# EAGLE design FRA_daughter_v2 (EAGLE 7.6.0)
CNAME: Sensor board v1; CREVISION: 01
Assembly variants: ESP8266 CH340 default
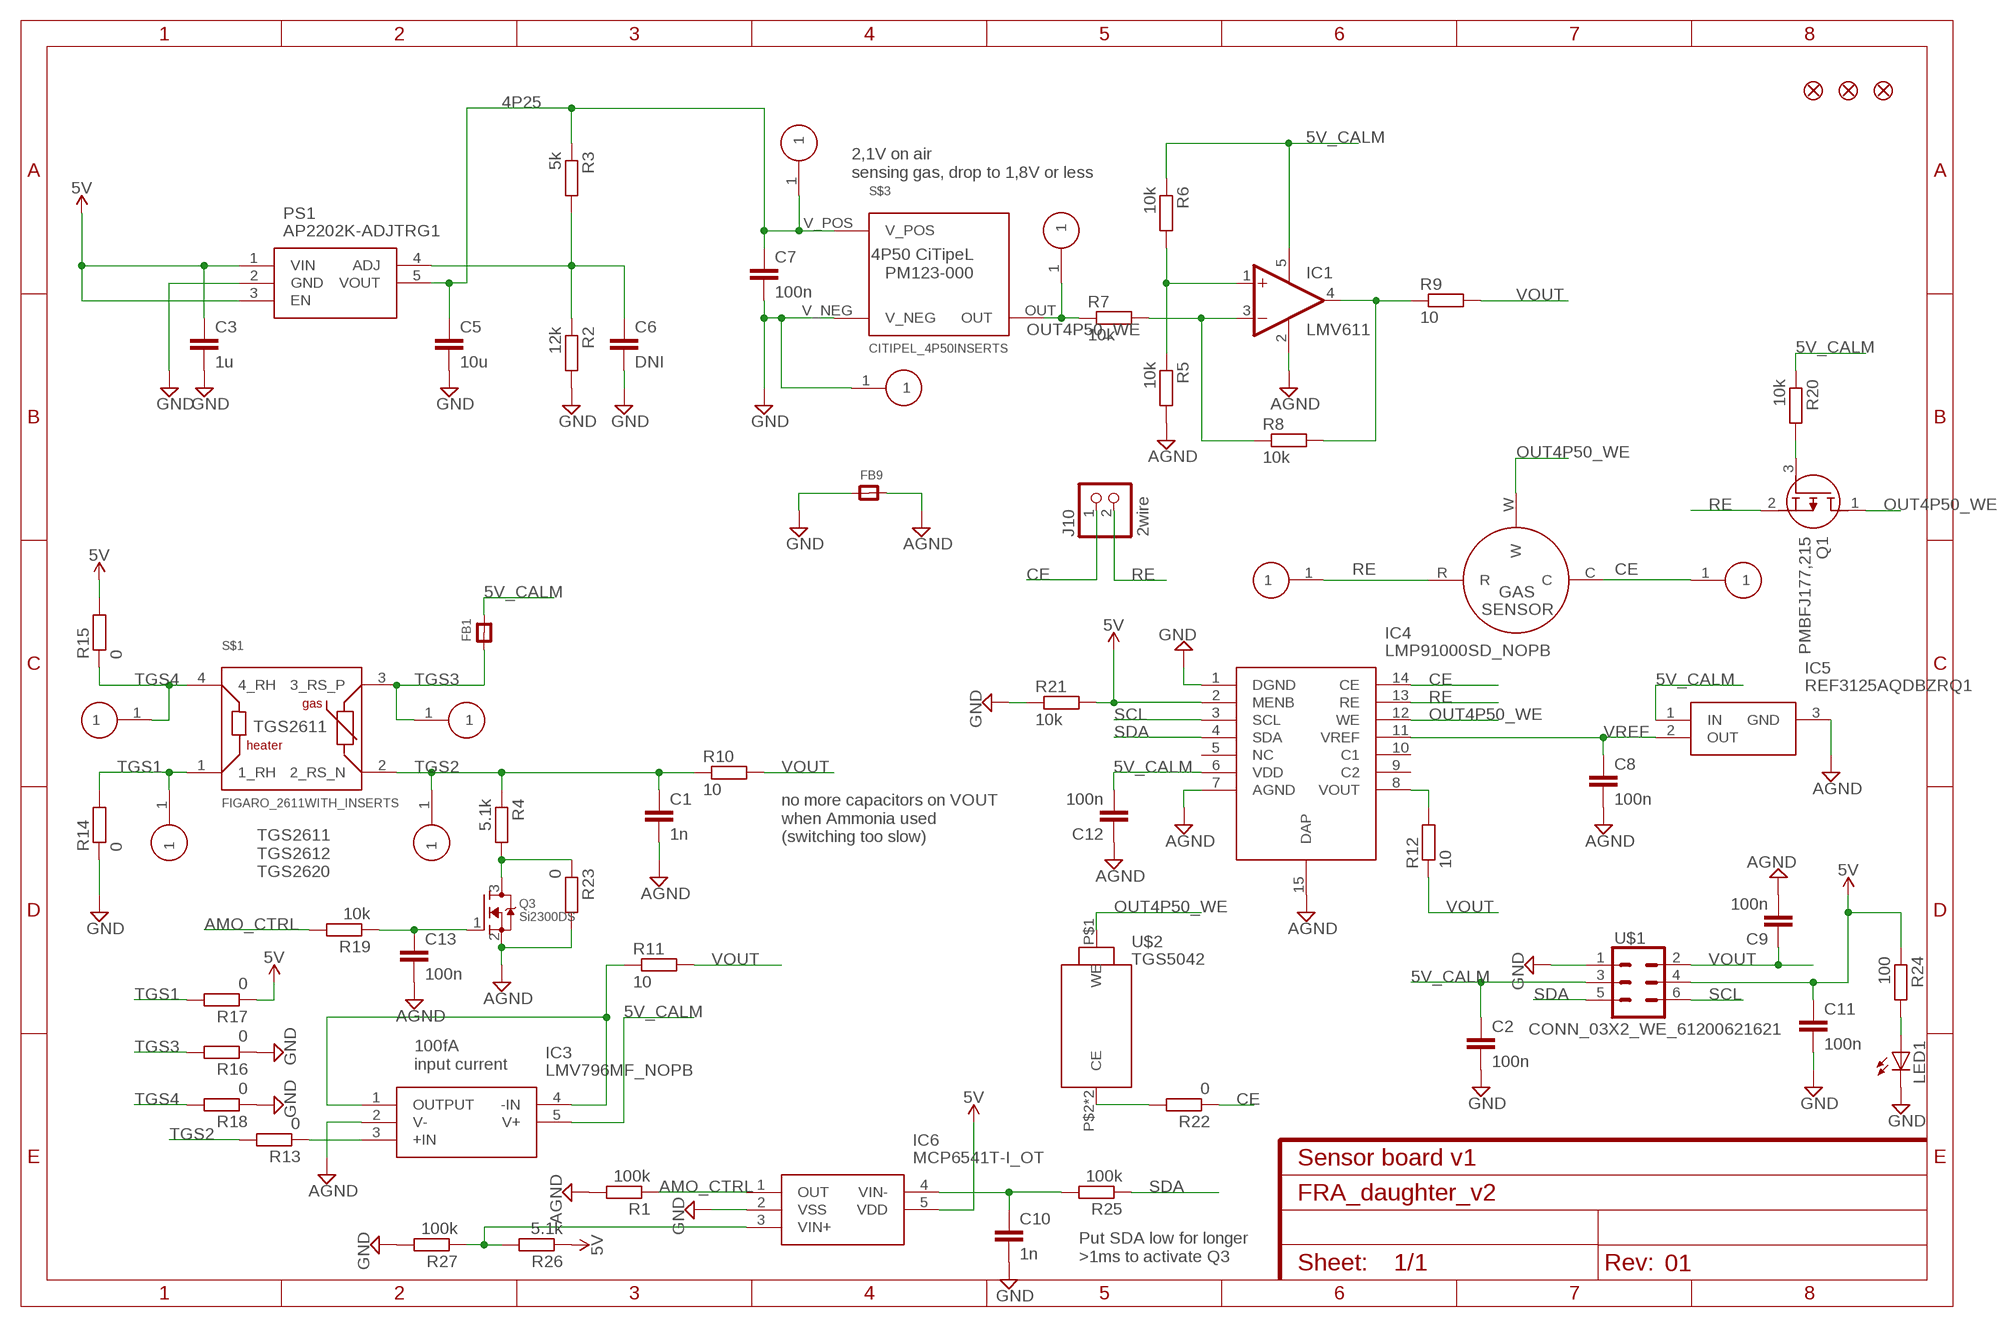
[diagram p0: schematic, sheet 1]

## Parts
C1  1n  C-EUC0603K  [C0603K]
C2  100n  C-EUC0603K  [C0603K]
C3  1u  C-EUC0603K  [C0603K]
C5  10u  C-EUC0603K  [C0603K]
C6  DNI  C-EUC0603K  [C0603K]
C7  100n  C-EUC0603K  [C0603K]
C8  100n  C-EUC0603K  [C0603K]
C9  100n  C-EUC0603K  [C0603K]
C10  1n  C-EUC0603K  [C0603K]
C11  100n  C-EUC0603K  [C0603K]
C12  100n  C-EUC0603K  [C0603K]
C13  100n  C-EUC0603K  [C0603K]
FB1  FERRITE  [0603]
FB9  FERRITE  [0603]
FID1  FIDUCIAL""  [FIDUCIAL_1MM]
FID2  FIDUCIAL""  [FIDUCIAL_1MM]
FID4  FIDUCIAL""  [FIDUCIAL_1MM]
IC1  LMV611  OPA333DCK  [SC70-5L]
IC3  LMV796MF_NOPB  [SOT95P280X145-5N]
IC4  LMP91000SD_NOPB  [SON50P400X400X80-15N]
IC5  REF3125AQDBZRQ1  [SOT95P237X112-3N]
IC6  MCP6541T-I_OT  [SOT95P270X145-5N]
J1  INSERT_MM5_06691.5MM  [INSERT_1MM5_9372]
J2  TGS3  INSERT_MM5_0669  [INSERT_MM5_0669]
J3  TGS2  INSERT_MM5_0669  [INSERT_MM5_0669]
J4  TGS1  INSERT_MM5_0669  [INSERT_MM5_0669]
J5  TGS4  INSERT_MM5_0669  [INSERT_MM5_0669]
J6  INSERT_MM5_06691.5MM  [INSERT_1MM5_9372]
J7  INSERT_MM5_06691.5MM  [INSERT_1MM5_9372]
J8  INSERT_MM5_06691.5MM  [INSERT_1MM5_9372]
J9  INSERT_MM5_06691.5MM  [INSERT_1MM5_9372]
J10  2wire  PINHD-1X2  [1X02]
LED1  LEDCHIP-LED0603  [CHIP-LED0603]
PS1  AP2202K-ADJTRG1  [SOT95P280X145-5N]
Q1  PMBFJ177,215  [SOT95P230X110-3N]
Q3  Si2300DS  MOSFET-NREFLOW  [SOT23]
R1  100k  R-EU_R0603  [R0603]
R2  12k  R-EU_R0603  [R0603]
R3  5k  R-EU_R0603  [R0603]
R4  5.1k  R-EU_R0603  [R0603]  (not fitted in variant ESP8266 CH340 default)
R5  10k  R-EU_R0603  [R0603]
R6  10k  R-EU_R0603  [R0603]
R7  10k  R-EU_R0603  [R0603]
R8  10k  R-EU_R0603  [R0603]
R9  10  R-EU_R0603  [R0603]
R10  10  R-EU_R0603  [R0603]
R11  10  R-EU_R0603  [R0603]
R12  10  R-EU_R0603  [R0603]
R13  0  R-EU_R0603  [R0603]
R14  0  R-EU_R0603  [R0603]
R15  0  R-EU_R0603  [R0603]
R16  0  R-EU_R0603  [R0603]
R17  0  R-EU_R0603  [R0603]
R18  0  R-EU_R0603  [R0603]
R19  10k  R-EU_R0603  [R0603]
R20  10k  R-EU_R0603  [R0603]
R21  10k  R-EU_R0603  [R0603]
R22  0  R-EU_R0603  [R0603]
R23  0  R-EU_R0603  [R0603]
R24  100  R-EU_R0603  [R0603]
R25  100k  R-EU_R0603  [R0603]
R26  5.1k  R-EU_R0603  [R0603]
R27  100k  R-EU_R0603  [R0603]
S$1  FIGARO_2611WITH_INSERTS  [TH4_TGS2611_INSERTS]
S$3  CITIPEL_4P50INSERTS  [TH3_4P50_INSERTS]
U$1  CONN_03X2_WE_61200621621  [WE_61200621621]
U$2  TGS5042  [TGS5042]
X1  3-ELECTRODE-GAS-SENSORINS  [3-ELECTRODE_INSETRS]

## Nets
4P25: C5.1 C7.1 J6.1 PS1.5(VOUT) R3.1 S$3.V_POS
5V: C3.1 C11.1 IC4.2(MENB) IC6.5(VDD) PS1.1(VIN) PS1.3(EN) R15.2 R17.1 R21.2 R24.1 R26.1 U$1.4
5V_CALM: C2.1 C12.2 FB1.2 IC1.5(V+) IC3.5(V+) IC4.6(VDD) IC5.1(IN) R6.1 R20.1 U$1.3
AGND: C1.2 C8.2 C9.2 C12.1 C13.2 FB9.2 IC1.2(V-) IC3.2(V-) IC4.7(AGND) IC4.15(DAP) IC5.3(GND) Q3.2(S) R1.2 R5.2 R23.2
AMO_CTRL: IC6.1(OUT) R1.1 R19.2
CE: IC4.14(CE) J9.1 J10.1 R22.1 X1.C
GND: C2.2 C3.2 C5.2 C6.2 C7.2 C10.2 C11.2 FB9.1 IC4.1(DGND) IC6.2(VSS) J1.1 LED1.C PS1.2(GND) R2.2 R14.1 R16.1 R18.1 R21.1 R27.2 S$3.V_NEG U$1.1
N$1: LED1.A R24.2
N$2: C6.1 PS1.4(ADJ) R2.1 R3.2
N$3: IC4.8(VOUT) R12.2
N$4: IC1.1(+IN) R5.1 R6.2
N$5: IC1.3(-IN) R7.2 R8.1
N$6: IC1.4(OUT) R8.2 R9.1
N$7: IC3.1(OUTPUT) IC3.4(-IN) R11.1
N$8: C13.1 Q3.1(G) R19.1
N$9: Q1.3(G) R20.2
N$10: IC3.3(+IN) R13.1
N$15: Q3.3(D) R4.2 R23.1
N$19: R22.2 U$2.P$2(CE) U$2.P$3(CE)
N$21: C10.1 IC6.4(VIN-) R25.2
N$23: IC6.3(VIN+) R26.2 R27.1
OUT4P50_WE: IC4.12(WE) J7.1 Q1.1(D) R7.1 S$3.OUT U$2.P$1(WE) X1.W
RE: IC4.13(RE) J8.1 J10.2 Q1.2(S) X1.R
SCL: IC4.3(SCL) U$1.6
SDA: IC4.4(SDA) R25.1 U$1.5
TGS1: J4.1 R14.2 R17.2 S$1.1(1_RH)
TGS2: C1.1 J3.1 R4.1 R10.1 R13.2 S$1.2(2_RS_N)
TGS3: FB1.1 J2.1 R16.2 S$1.3(3_RS_P)
TGS4: J5.1 R15.1 R18.2 S$1.4(4_RH)
VOUT: C9.1 R9.2 R10.2 R11.2 R12.1 U$1.2
VREF: C8.1 IC4.11(VREF) IC5.2(OUT)
Unconnected: IC4.5(NC) IC4.9(C2) IC4.10(C1)

## Notes on the sheet
- 2,1V on air
  sensing gas, drop to 1,8V or less
- no more capacitors on VOUT
  when Ammonia used
  (switching too slow)
- TGS2611
  TGS2612
  TGS2620
- 100fA
  input current
- Put SDA low for longer
  >1ms to activate Q3

## Library data of the parts
C1-C3 C5-C13 = resistor:C-EU: CAPACITOR, European symbol
FB1 FB9 = microbuilder:FERRITE: Ferrite Bead 0603 MMZ1608B121C - 120 Ohm @ 100MHz, 600mA, 0.15 Ohm DC Resistance - Digikey: 445-2164-1-ND BK1608HW121-T - 120 Ohm, 600mA Ferrite Chip - Digikey: 587-1876-2-ND 0805 HZ0805B272R-10 - 2.7K Ohm @ 100MHz, 200mA, 0.8 Ohm DC Resistance - Digikey: 240-2504-1-ND (see also Murata BLM21BD272SN1L) MMZ2012Y152B - 1.5K Ohm @ 100MHz, 500mA, 0.4 Ohm DC Resistance - Digikey: 445-1560-1-ND - Mainly for high frequency (80-400MHz) MMZ2012R102A - 1K Ohm @ 100MHz, 500mA, 0.3 Ohm DC Resistance - Digikey: 445-1555-2-ND - More general purpose (10-200MHz); PARTNO: BLM18PG121SN1D
FID1 FID2 FID4 = microbuilder:FIDUCIAL: Fiducial Alignment Points Various fiducial points for machine vision alignment.
IC1 = linear:OPA333: 1.8V, microPOWER CMOS OPERATIONAL AMPLIFIERS Zerø-Drift Series Source: Texas Instruments (Burr-Brown) .. U11 opa333 Operational Amp.pdf
IC3 = SamacSys_Parts:LMV796MF_NOPB: Single 17 MHz, low noise, CMOS input, 1.8V operational amplifier Source: Datasheet <http://www.ti.com/lit/ds/symlink/lmv796.pdf>; DESCRIPTION: Single 17 MHz, low noise, CMOS input, 1.8V operational amplifier; HEIGHT: 1.45mm; MANUFACTURER_NAME: Texas Instruments; MANUFACTURER_PART_NUMBER: LMV796MF/NOPB; MOUSER_PART_NUMBER: 926-LMV796MF/NOPB; MOUSER_PRICE-STOCK: https://www.mouser.com/Search/Refine.aspx?Keyword=926-LMV796MF%2FNOPB
IC4 = SamacSys_Parts:LMP91000SD_NOPB: Configurable AFE Potentiostat for Low-Power Chemical Sensing Applications Source: Datasheet <http://www.ti.com/lit/ds/symlink/lmp91000.pdf>; DESCRIPTION: Configurable AFE Potentiostat for Low-Power Chemical Sensing Applications; HEIGHT: 0.8mm; MANUFACTURER_NAME: Texas Instruments; MANUFACTURER_PART_NUMBER: LMP91000SD/NOPB; MOUSER_PART_NUMBER: 926-LMP91000SD/NOPB; MOUSER_PRICE-STOCK: https://www.mouser.com/Search/Refine.aspx?Keyword=926-LMP91000SD%2FNOPB
IC5 = SamacSys_Parts:REF3125AQDBZRQ1: Automotive 20-ppm/C (max), 100-A, 3-pin SOT-23 series voltage reference Source: Datasheet <http://www.ti.com/lit/gpn/ref31-q1>; DESCRIPTION: Automotive 20-ppm/C (max), 100-A, 3-pin SOT-23 series voltage reference; HEIGHT: 1.12mm; MANUFACTURER_NAME: Texas Instruments; MANUFACTURER_PART_NUMBER: REF3125AQDBZRQ1; MOUSER_PART_NUMBER: 595-REF3125AQDBZRQ1; MOUSER_PRICE-STOCK: https://www.mouser.com/Search/Refine.aspx?Keyword=595-REF3125AQDBZRQ1
IC6 = SamacSys_Parts:MCP6541T-I_OT: Comparator Push-Pull RRIO 1.6V SOT23-5 Source: Datasheet <https://componentsearchengine.com/Datasheets/1/MCP6541T-I_OT.pdf>; DESCRIPTION: Comparator Push-Pull RRIO 1.6V SOT23-5; HEIGHT: 1.45mm; MANUFACTURER_NAME: Microchip; MANUFACTURER_PART_NUMBER: MCP6541T-I/OT; MOUSER_PART_NUMBER: 579-MCP6541T-I/OT; MOUSER_PRICE-STOCK: https://www.mouser.com/Search/Refine.aspx?Keyword=579-MCP6541T-I%2FOT
J1-J9 = FRA_eagle_lib:INSERT_MM5_0669
J10 = pinhead:PINHD-1X2: PIN HEADER; PARTNO: TSW-102-07-G-S
LED1 = adafruit:LED: LED OSRAM: - CHIPLED LG R971, LG N971, LY N971, LG Q971, LY Q971, LO R971, LY R971 LH N974, LH R974 LS Q976, LO Q976, LY Q976 LO Q996 - Hyper CHIPLED LW Q18S LB Q993, LB Q99A, LB R99A - SideLED LS A670, LO A670, LY A670, LG A670, LP A670 LB A673, LV A673, LT A673, LW A673 LH A674 LY A675 LS A676, LA A676, LO A676, LY A676, LW A676 LS A679, LY A679, LG A679 - Hyper Micro SIDELED® LS Y876, LA Y876, LO Y876, LY Y876 LT Y87S - SmartLED LW L88C, LW L88S LB L89C, LB L89S, LG L890 LS L89K, LO L89K, LY L89K LS L896, LA L896, LO L896, LY L896 - TOPLED LS T670, LO T670, LY T670, LG T670, LP T670 LSG T670, LSP T670, LSY T670, LOP T670, LYG T670 LG T671, LOG T671, LSG T671 LB T673, LV T673, LT T673, LW T673 LH T674 LS T676, LA T676, LO T676, LY T676, LB T676, LH T676, LSB T676, LW T676 LB T67C, LV T67C, LT T67C, LS T67K, LO T67K, LY T67K, LW E67C LS E67B, LA E67B, LO E67B, LY E67B, LB E67C, LV E67C, LT E67C LW T67C LS T679, LY T679, LG T679 LS T770, LO T770, LY T770, LG T770, LP T770 LB T773, LV T773, LT T773, LW T773 LH T774 LS E675, LA E675, LY E675, LS T675 LS T776, LA T776, LO T776, LY T776, LB T776 LHGB T686 LT T68C, LB T68C - Hyper Mini TOPLED® LB M676 - Mini TOPLED Santana® LG M470 LS M47K, LO M47K, LY M47K Source: http://www.osram.convergy.de/
PS1 = SamacSys_Parts:AP2202K-ADJTRG1: DiodesZetex AP2202K-ADJTRG1, Low Noise LDO Voltage Regulator, Adjustable 150mA, 2.3 13.2 V +/-2%, 5-Pin SOT-23 Source: Datasheet <https://componentsearchengine.com/Datasheets/1/AP2202K-ADJTRG1.pdf>; DESCRIPTION: DiodesZetex AP2202K-ADJTRG1, Low Noise LDO Voltage Regulator, Adjustable 150mA, 2.3 13.2 V +/-2%, 5-Pin SOT-23; HEIGHT: 1.45mm; MANUFACTURER_NAME: Diodes Inc.; MANUFACTURER_PART_NUMBER: AP2202K-ADJTRG1; MOUSER_PART_NUMBER: 621-AP2202K-ADJTRG1; MOUSER_PRICE-STOCK: https://www.mouser.com/Search/Refine.aspx?Keyword=621-AP2202K-ADJTRG1
Q1 = SamacSys_Parts:PMBFJ177,215: NXP PMBFJ177,215 P-channel JFET Transistor, 30 V, Idss 1.5 20mA, 3-Pin SOT-23 Source: Datasheet <https://componentsearchengine.com/Datasheets/1/PMBFJ177,215.pdf>; DESCRIPTION: NXP PMBFJ177,215 P-channel JFET Transistor, 30 V, Idss 1.5 20mA, 3-Pin SOT-23; HEIGHT: 1.1mm; MANUFACTURER_NAME: Nexperia; MANUFACTURER_PART_NUMBER: PMBFJ177,215; MOUSER_PART_NUMBER: 771-PMBFJ177-T/R; MOUSER_PRICE-STOCK: https://www.mouser.com/Search/Refine.aspx?Keyword=771-PMBFJ177-T%2FR
Q3 = adafruit:MOSFET-N: N-Channel Mosfet 2N7002E - 60V 260mA SOT23 [Digikey: 2N7002ET1GOSTR-ND] - REEL BSH103 - 30V 850mA SOT23 [Digikey: 568-5013-1-ND]
R1-R27 = resistor:R-EU_: RESISTOR, European symbol
S$1 = FRA_eagle_lib:FIGARO_2611: Combustible gas sensor Figaro TGS2611 Figaro TGS2611 datasheet <https://www.figaro.co.jp/en/product/docs/tgs2611_product_information_rev02.pdf> Heater and Cicuit Voltage: 5V +- 0.2 VDC
S$3 = FRA_eagle_lib:CITIPEL_4P50: Combustible gas sensor CiTiPeL 4P50 datasheet <https://www.citytech.com.cn/pdf-datasheets/4p50.pdf> Operating Voltage: 4.25V +- 0.02 VDC Operating current 56+- 6 mA Sensitivity 37mV +- 7mV/%methane
U$1 = FRA_eagle_lib:CONN_03X2_WE_61200621621: https://eu.mouser.com/ProductDetail/Wurth-Elektronik/61200621621?qs=sGAEpiMZZMs%252BGHln7q6pm%2FFhW%252BtWvhAgbNxkR%252BlwXp8Ip%2FAN9J9VOg%3D%3D https://eu.mouser.com/datasheet/2/445/6120xx21621-265830.pdf
U$2 = FRA_eagle_lib:TGS5042: TGS5042 CO sensor
X1 = gas-sensor:3-ELECTRODE-GAS-SENSOR: 3 electrode electrochemical sensors

## Board
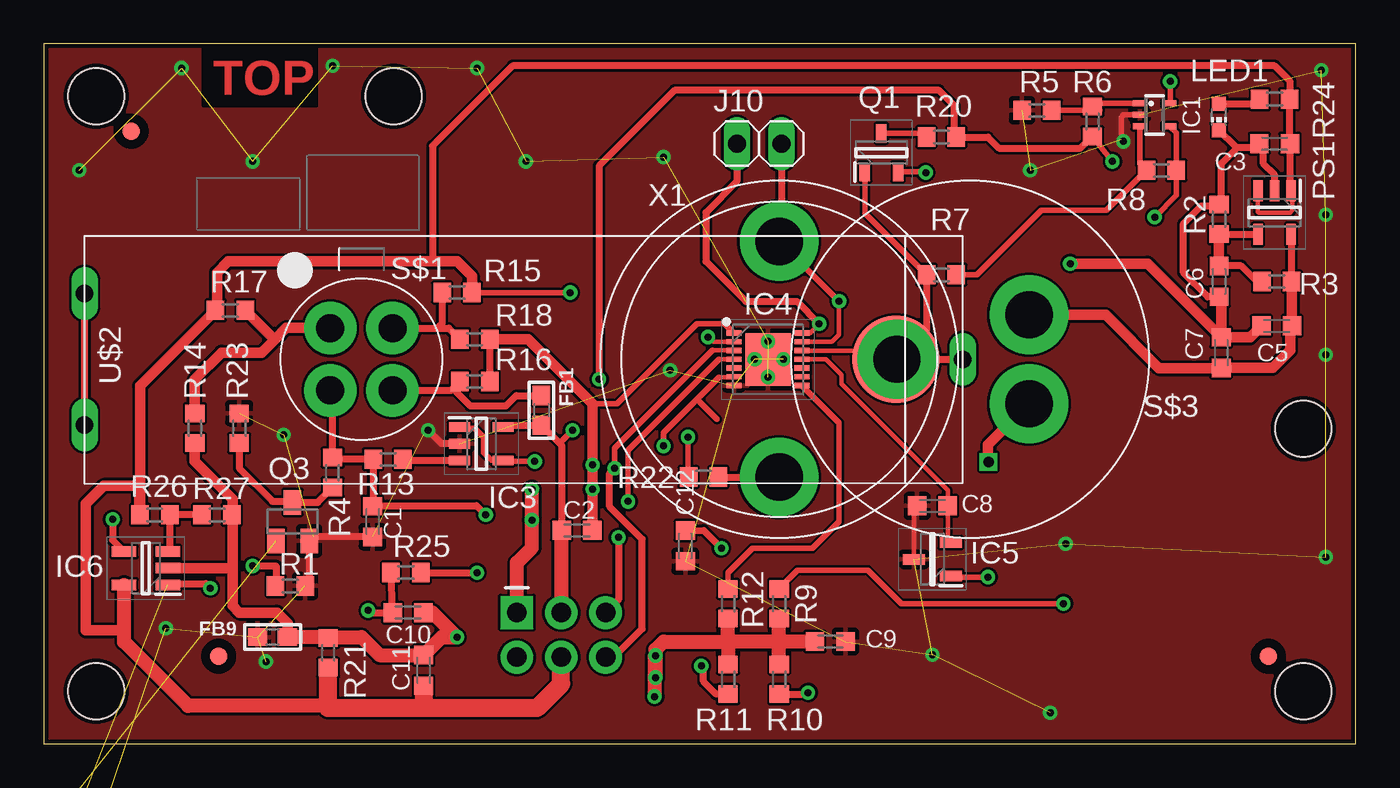
[diagram p1: board, top side]
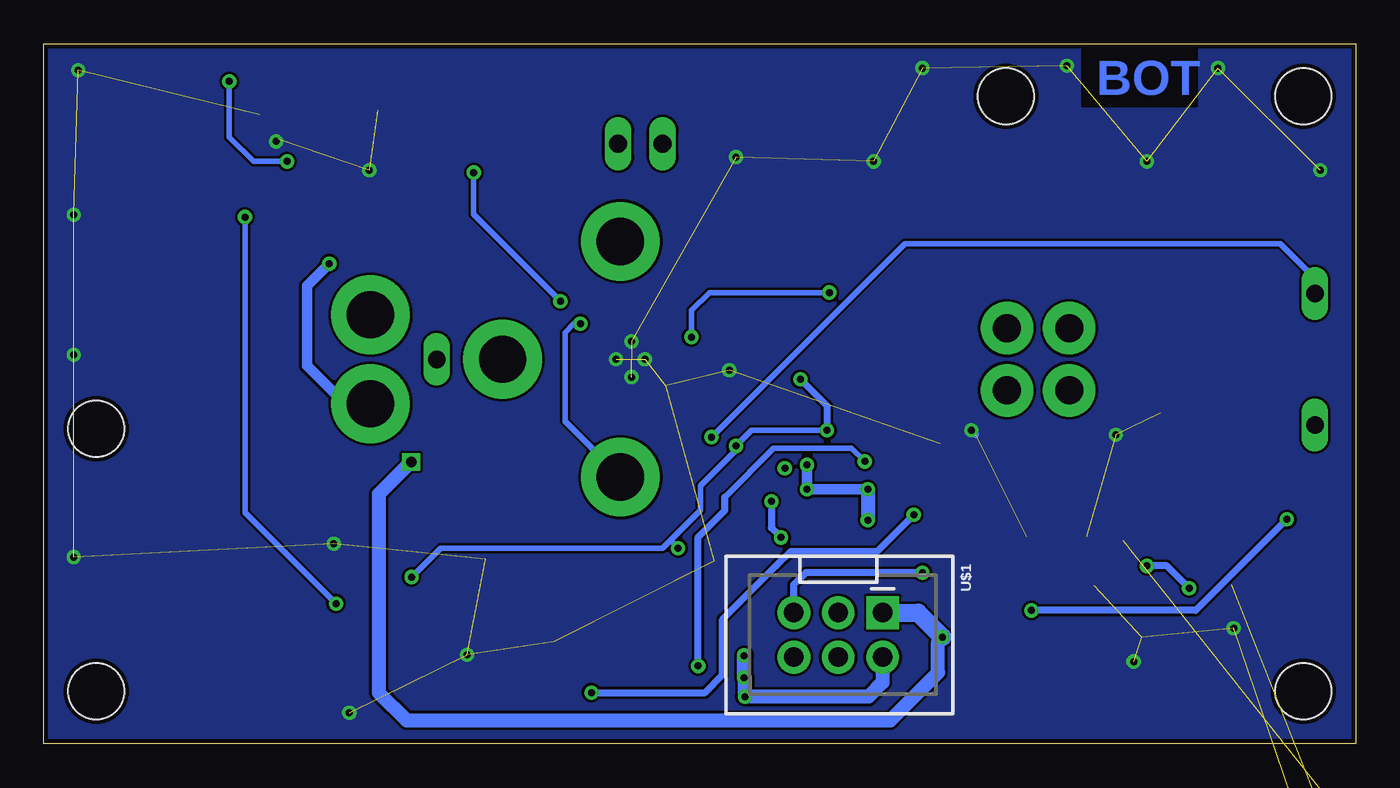
[diagram p2: board, bottom side, seen from below]

Size 75 x 40 mm. Coordinates in mm from the lower left corner, seen from the top.
Outline: 0,0 75,0 75,40 0,40 0,0
Copper layers (1*16): Top 0.035mm / dielectric 1.6mm / Bottom 0.035mm
Design rules "AllPCB": minimum track width 6mil, minimum drill 0.399mm, track to track 0.149859375mm, track to pad 0.149859375mm, pad to pad 8mil, via to via 17mil, smd to smd 6mil, copper to edge 10mil, drill to drill 24mil, minimum pad ring 10mil, minimum via ring 8mil, stop-mask expansion 4mil, vias tented up to drill 0.3mm, thermal gap 10mil
Holes 3.2 mm at 3,37 3,3 72,3 72,18 20,37
tRestrict: area 39.9,21.6 to 40.1,22.2; area 42.7,21.6 to 42.9,22.4; area 9,36.4 to 15.7,39.7
bRestrict: area 9,36.4 to 15.7,39.7

### Footprints (pad centres in the part's own frame; a part is rotated, then mirrored left to right if it is on the bottom)
C0603K = smd 1.05 x 1.08: 1 -0.875,0; 2 0.875,0
0603 = smd 1.1 x 1: 1 -0.85,0; 2 0.85,0
FIDUCIAL_1MM = smd 1 x 1: 1 0,0
SC70-5L = smd 0.35 x 0.8: 1 -0.65,-0.85; 2 0,-0.85; 3 0.65,-0.85; 4 0.65,0.85; 5 -0.65,0.85
SOT95P280X145-5N = smd 1.2 x 0.55: 1 -1.25,0.95; 2 -1.25,0; 3 -1.25,-0.95; 4 1.25,-0.95; 5 1.25,0.95
SON50P400X400X80-15N = smd 0.85 x 0.3: 1 -1.95,1.5; 2 -1.95,1; 3 -1.95,0.5; 4 -1.95,0; 5 -1.95,-0.5; 6 -1.95,-1; 7 -1.95,-1.5; 8 1.95,-1.5; 9 1.95,-1; 10 1.95,-0.5; 11 1.95,0; 12 1.95,0.5; 13 1.95,1; 14 1.95,1.5 | smd 2.6 x 3: 15 0,0
SOT95P237X112-3N = smd 1.25 x 0.6: 1 -1.05,0.95; 2 -1.05,-0.95; 3 1.05,0
SOT95P270X145-5N = smd 1.4 x 0.6: 1 -1.25,0.95; 2 -1.25,0; 3 -1.25,-0.95; 4 1.25,-0.95; 5 1.25,0.95
INSERT_1MM5_9372 = drill 2.7 pad 4.5: 1 0,0
INSERT_MM5_0669 = drill 1.6 pad 3: 1 0,0
1X02 = drill 1.016 long: 1 -1.27,0; 2 1.27,0
CHIP-LED0603 = smd 0.8 x 0.8: A 0,-0.75; C 0,0.75
SOT95P230X110-3N = smd 1.05 x 0.6: 1 -1.1,0.95; 2 -1.1,-0.95; 3 1.1,0
SOT23 = smd 1 x 1.4: 1 -0.95,-1.1; 2 0.95,-1.1; 3 0,1.1
R0603 = smd 1 x 1.1: 1 -0.85,0; 2 0.85,0
TH4_TGS2611_INSERTS = smd 2.5 x 2.5: 1 -1.8,1.8; 2 -1.8,-1.8; 3 1.8,-1.8; 4 1.8,1.8
TH3_4P50_INSERTS = smd 5 x 5: OUT 4.24,0 | smd 3.81 x 3.81: V_NEG -3.38,2.54; V_POS -3.38,-2.54
WE_61200621621 = drill 1.1 pad 1.88 square: 1 -1.27,2.54 | drill 1.1 pad 1.88: 2 1.27,2.54; 3 -1.27,0; 4 1.27,0; 5 -1.27,-2.54; 6 1.27,-2.54
TGS5042 = drill 1 long: P$1 0,25.1; P$2 -3.75,-25.1; P$3 3.75,-25.1
3-ELECTRODE_INSETRS = smd 3.7 x 3.7: C 6.75,0; R -6.75,0; W 0,6.75

### Placement (x,y rotation side)
C1  18.8,12.7 270 top
C2  30.48,12.19 0 top
C3  70.36,34.29 180 top
C5  70.48,23.88 180 top
C6  67.18,26.42 270 top
C7  67.31,22.35 90 top
C8  50.8,13.59 180 top
C9  44.96,5.84 0 top
C10  20.83,7.49 0 top
C11  21.72,4.19 90 top
C12  36.68,11.3 90 top
C13  0.36,-10.21 0 top  (outside the outline)
FB1  28.45,19.05 270 top
FB9  13.08,6.1 180 top
FID1  10,5 0 top
FID2  5,35 0 top
FID4  70,5 0 top
IC1  63.5,35.94 270 top
IC3  25.02,17.14 0 top
IC4  41.4,21.97 0 top
IC5  50.8,10.54 180 top
IC6  5.84,10.03 180 top
J1  56.32,19.43 180 bottom
J2  19.94,20.19 0 bottom
J3  16.38,20.19 0 bottom
J4  16.38,23.75 0 bottom
J5  19.94,23.75 0 bottom
J6  56.32,24.51 180 bottom
J7  48.77,21.97 0 top
J8  42.04,28.7 0 top
J9  42.04,15.24 0 top
J10  40.89,34.29 0 top
LED1  67.18,35.81 180 top
PS1  70.36,30.35 270 top
Q1  47.88,33.78 90 top
Q3  14.22,12.7 0 top
R1  14.1,9.02 0 top
R2  67.18,29.97 90 top
R3  70.48,26.42 180 top
R4  16.51,15.49 270 top
R5  56.77,36.2 180 top
R6  59.94,35.56 90 top
R7  51.31,26.8 0 top
R8  63.88,32.77 0 top
R9  42.04,8 270 top
R10  42.04,3.68 90 top
R11  39.12,3.68 90 top
R12  39.12,8 90 top
R13  19.68,16.26 180 top
R14  8.64,18.03 90 top
R15  23.62,25.78 0 top
R16  24.64,20.7 180 top
R17  10.67,24.77 0 top
R18  24.64,23.11 180 top
R19  0.36,-5.76 0 top  (outside the outline)
R20  51.31,34.67 180 top
R21  16.26,5.21 270 top
R22  37.72,15.24 180 top
R23  11.18,18.03 90 top
R24  70.36,36.83 180 top
R25  20.7,9.78 180 top
R26  6.35,13.08 0 top
R27  9.91,13.08 0 top
S$1  18.16,21.97 0 top
S$3  52.96,21.97 180 top
U$1  29.58,6.22 270 bottom
U$2  27.43,21.97 270 top
X1  42.04,21.97 270 top

### Tracks (layer width: path | path; a pad name or v marks a point on that pad's centre or on a via)
4P25
  Top 0.406: PS1.5 71.31,26.44 R3.1 | S$3.V_POS J6.1
  Top 0.61: S$3.V_POS 60.71,24.51 63.75,21.46 67.3,21.46 C7.1 70.25,21.48 71.25,22.48 71.25,23.76 C5.1 71.33,23.9 R3.1
5V  (via drill 0.4 pad 0.81)
  Top 0.254: PS1.3 69.41,30.41 69.47,30.35 71.25,30.35 71.37,30.48 71.37,31.54 | 71.37,31.54 PS1.1 | v37.97,23.24 38.24,22.97 IC4.2 | 71.37,31.54 71.37,31.62 71.25,31.75 71.25,36.83
  Top 0.305: v30.1,25.78 R15.2
  Top 0.406: PS1.1 71.23,31.68 C3.1 71.21,34.31 R24.1 | 71.25,36.83 71.25,37.85 70.36,38.73 26.8,38.73 22.23,34.16 22.23,27.56
  Top 0.61: 4.59,6.48 2.41,6.48 2.41,13.72 3.43,14.73 5.46,14.73 5.46,13.12 R26.1 5.5,20.45 R17.1 9.91,24.85 9.91,26.92 10.54,27.56 22.23,27.56 23.62,27.56 24.47,26.71 R15.2
  Top 0.813: 16.26,2.16 8.26,2.16 4.59,5.82 4.59,6.48 IC6.5
  Top 1.016: 21.72,2.03 28.19,2.03 29.59,3.43 29.58,3.43 U$1.4 | C11.1 21.72,2.03 | 21.72,2.03 16.26,2.03 16.26,2.16 R21.2
  Bottom 0.305: v37.97,23.24 37.97,24.77 36.96,25.78 v30.1,25.78
5V_CALM  (via drill 0.4 pad 0.81)
  Top 0.254: IC4.6 39.44,20.95 38.61,20.95
  Top 0.305: R6.1 60.58,33.91 v61.09,33.27 | v64.39,37.85 64.39,36.63 IC1.5 | 38.61,20.95 37.34,19.68 | 37.34,19.68 35.43,17.78 v35.43,17.02 | v30.23,17.91 29.61,17.29 29.61,17.04 | IC5.1 51.92,9.53 v53.98,9.53 | 38.48,18.54 37.34,19.68
  Top 0.406: R6.1 59.27,34.04 54.61,34.04 53.98,34.67 R20.1 52.07,34.76 52.07,36.45 51.18,37.34 36.07,37.34 31.75,33.02 v31.75,20.83 | IC3.5 26.37,18.2 FB1.2 29.61,17.04 C2.1 | C12.2 37.72,12.19 v38.73,11.18
  Top 0.813: 29.59,12.18 C2.1 29.58,12.19 U$1.3
  Bottom 0.305: v61.09,33.27 62.99,33.27 64.39,34.67 v64.39,37.85 | v30.23,17.91 34.54,17.91 v35.43,17.02 35.43,16.76 37.47,14.73 37.47,13.34 39.18,11.62 | v53.98,9.53 52.32,11.18 39.62,11.18 39.18,11.62 | v38.73,11.18 39.18,11.62
  Bottom 0.406: v31.75,20.83 30.23,19.3 v30.23,17.91
AGND  (via drill 0.4 pad 0.81)  (34 unrouted)
  Top 0.254: IC5.3 49.75,13.41 C8.2
  Top 0.305: IC1.2 61.72,35.94 61.59,35.81 61.59,34.54 v61.72,34.42
  Top 0.406: C1.2 15.4,11.82 Q3.2 15.17,9.24 R1.2 | IC3.2 22.73,17.14 v21.97,17.91
  Bottom 0.406: v21.97,17.91 21.72,17.65
  other vias: 12.7,4.7 40.64,21.97 42.29,21.97 41.4,22.99 41.4,20.95 6.99,6.6 2.03,32.77 7.87,38.61 16.51,38.73 24.77,38.61 73.03,38.48 27.56,33.27 35.43,33.53 11.94,33.27 73.28,22.23 73.28,30.23 73.28,10.67 57.53,1.78 50.8,5.08 35.81,21.34 56.39,32.77 13.72,17.65 58.42,11.43
  pour Bottom: 0,0 74.93,0 74.93,40.01 0,40.01
  pour Top: 0,40.01 74.93,40.01 74.93,0 0,0
AMO_CTRL  (via drill 0.4 pad 0.81)  (1 unrouted)
  Top 0.406: R1.1 13.27,9.04 13.27,10.16 v11.94,10.16 | IC6.1 7.15,9.14 9.27,9.14 v9.53,8.89
  Bottom 0.406: v9.53,8.89 10.79,10.16 v11.94,10.16
CE  (via drill 0.4 pad 0.81)
  Top 0.254: IC4.14 43.79,23.47 v44.32,24
  Top 0.406: R22.1 42.02,15.24 | 42.02,15.24 X1.C | J10.1 39.62,32.13 37.85,30.35 37.85,27.56 40.13,25.27 43.05,25.27 v44.32,24 | 42.02,15.24 J9.1
  Top 0.813: X1.C J9.1
  Bottom 0.254: 42.06,15.24 X1.C
  Bottom 0.305: v44.32,24 44.7,24 45.21,23.5 45.21,18.41 J9.1
  Bottom 0.813: X1.C J9.1
GND  (via drill 0.4 pad 0.81, 0.6)
  Top 0.305: IC4.1 38.92,24 37.34,24 32.77,19.43 31.37,19.43
  Top 0.406: C6.2 66.53,25.54 65.15,26.92 65.15,29.72 66.17,30.73 67.09,30.73 R2.2 67.31,30.95 67.31,33.15 68.14,33.98 68.14,34.1 | PS1.2 70.36,32.51 69.72,33.15 69.72,34.05 | 69.72,34.05 C3.2 | R18.1 R16.1 | 69.72,34.05 68.2,34.05 68.14,34.1 | 68.14,34.1 LED1.C | S$3.V_NEG J1.1
  Top 0.61: C7.2 68.96,23.23 C5.2 | C7.2 67.31,25.41 C6.2 | v58.67,27.43 63.1,27.43 C7.2 | R14.1 8.64,16.13 10.79,13.97 10.79,13.12 R27.2 10.79,13.04 10.79,10.03 | C2.2 31.37,12.21 v31.37,14.54 31.37,19.43 27.69,23.11 R18.1 | J1.1 53.98,17.08 v53.98,16.14 | v53.98,16.14 v53.98,16.13 | 10.79,10.03 10.79,7.87 11.18,7.49 13.34,7.49 13.93,6.9 FB9.1 | IC6.2 10.79,10.03 | v53.98,16.14 v54,16.11 | v31.36,15.93 v31.36,14.54
  Top 0.813: C10.2 22.23,7.49 v23.62,6.1 22.75,6.1 C11.2 19.19,5.07 18.16,6.1 16.3,6.1 R21.1 16.22,6.1 FB9.1 | U$1.1 27.05,10.35 27.9,11.21 v27.9,12.78 v27.9,14.54
  Bottom 0.61: S$3.V_NEG 57.78,19.43 59.94,21.59 59.94,26.16 v58.67,27.43 | v31.37,14.54 v31.36,14.54 v31.36,15.93 | v31.36,14.54 v27.9,14.54
  Bottom 0.813: v23.62,6.1 23.88,5.84 23.88,4.06 26.61,1.33 54.25,1.33 55.84,2.92 55.84,14.27 v54,16.11 | S$3.V_NEG J1.1 | v27.9,14.54 v27.9,12.78
  Bottom 1.016: U$1.1 25.02,7.49 v23.62,6.1
N$1
  Top 0.406: LED1.A 69.24,36.56 R24.2
N$2
  Top 0.406: R3.2 69.34,26.42 68.45,27.3 67.2,27.3 C6.1 | R2.1 69.39,29.12 PS1.4
  Top 0.61: R2.1 C6.1
N$3
  Top 0.305: IC4.8 45.47,18.36 45.47,12.7 43.94,11.18 40.51,11.18 39.12,9.78 R12.2
N$4
  Top 0.305: R5.1 60.36,36.2 R6.2 59.87,36.59 IC1.1
N$5
  Top 0.305: IC1.3 62.65,33.15 R8.1 60.74,30.48 57.02,30.48 53.34,26.8 R7.2
N$6  (via drill 0.4 pad 0.81)
  Top 0.305: IC1.4 64.73,34.91 R8.2 64.73,31.33 v63.5,30.1 | R9.1 43.09,9.91 47.12,9.91 49.02,8 v58.29,8
  Bottom 0.305: v58.29,8 63.5,13.21 v63.5,30.1
N$7  (via drill 0.4 pad 0.81)
  Top 0.305: IC3.1 23.83,18.03 24.64,18.03 25.15,17.53 25.15,16.64 25.59,16.2 IC3.4 26.34,16.13 v28.07,16.13
  Top 0.406: R11.1 38.44,2.83 37.72,3.56 37.72,4.32 v37.59,4.45
  Bottom 0.305: v28.07,16.13 28.83,16.89 33.27,16.89 36.07,14.1
  Bottom 0.406: v37.59,4.45 37.59,11.81 36.07,13.34 36.07,14.1
N$8  (2 unrouted)
N$9
  Top 0.305: Q1.3 50.25,34.88 R20.2
N$10
  Top 0.406: R13.1 20.6,16.2 IC3.3
N$15
  Top 0.406: R4.2 15.67,13.8 Q3.3 14.18,13.84 13.08,13.84 11.18,15.75 R23.1
N$19  (via drill 0.4 pad 0.81)
  Top 0.305: R22.2 36.83,15.28 v36.83,17.53
  Top 0.406: U$2.P$3 U$2.P$2
  Bottom 0.305: v36.83,17.53 25.78,28.57 4.32,28.57 2.33,26.59 U$2.P$2
N$21  (via drill 0.4 pad 0.81)
  Top 0.406: R25.2 19.95,7.59 C10.1 18.67,7.49 v18.54,7.62 | v3.94,12.83 3.94,11.64 IC6.4
  Bottom 0.406: v3.94,12.83 9.14,7.62 v18.54,7.62
N$23
  Top 0.406: R27.1 R26.2 7.2,11.09 IC6.3
OUT4P50_WE
  Top 0.254: IC4.12 48.29,22.47 X1.W
  Top 0.305: Q1.1 46.93,30.33 R7.1
  Top 0.406: S$3.OUT J7.1 X1.W | X1.W U$2.P$1 | R7.1 50.46,23.64 X1.W
RE  (via drill 0.4 pad 0.81)
  Top 0.254: IC4.13 45.07,22.97 45.47,23.37 v45.47,25.29 X1.R J8.1
  Top 0.305: Q1.2 50.38,32.68 v50.42,32.64 | v45.47,25.29 45.45,25.29 J8.1
  Top 0.406: J10.2 42.16,28.83 J8.1
  Bottom 0.305: v50.42,32.64 50.42,30.25 v45.47,25.29
SCL  (via drill 0.4 pad 0.81)
  Top 0.254: IC4.3 38.23,22.48
  Top 0.305: 38.23,22.48 32.64,16.89 v32.64,15.75
  Top 0.406: U$1.6 32.58,4.95 34.2,6.57 34.2,11.7 32.35,13.54 32.35,15.46 v32.64,15.75
SDA  (via drill 0.4 pad 0.81)
  Top 0.254: IC4.4 38.61,21.97
  Top 0.305: 38.61,21.97 33.4,16.76 v33.4,13.84
  Top 0.406: R25.1 v24.77,9.78 | v32.85,11.79 32.85,8.22 U$1.5
  Bottom 0.406: v24.77,9.78 31.44,9.78 32.13,9.09 U$1.5 | v33.4,13.84 33.4,12.34 v32.85,11.79
TGS1
  Top 0.406: S$1.1 J4.1
  Top 0.61: R14.2 8.64,20.83 10.16,22.35 12.45,22.35 13.27,23.18 | 13.27,23.18 13.87,23.77 S$1.1 | R17.2 13.11,23.18 13.27,23.18
TGS2  (via drill 0.4 pad 0.81)
  Top 0.406: 18.84,13.61 R13.2 16.6,16.26 R4.1 16.51,20.02 S$1.2 J3.1 | 18.84,13.61 C1.1 | 18.84,13.61 24.74,13.61 v25.27,13.09 | R10.1 43.6,2.83 v43.69,2.92
  Bottom 0.406: v43.69,2.92 37.21,2.92 36.2,3.94 36.2,7.11 33.15,10.16 33.13,10.16 32.31,10.98 27.37,10.98 v25.27,13.09
TGS3
  Top 0.406: 23.28,20.19 J2.1 S$1.3 | 23.28,20.19 R16.2 | 23.28,20.19 23.5,20.19 24.38,19.3 26.42,19.3 27.01,19.9 FB1.1
TGS4
  Top 0.406: 22.48,23.75 J5.1 S$1.4 | 22.48,23.75 23.15,23.75 R18.2 | R15.1 22.77,24.04 22.48,23.75
VOUT  (via drill 0.4 pad 0.81)
  Top 0.813: 39.12,5.84 35.43,5.84 34.97,5.37 v34.97,5.04 | 39.12,5.84 R12.1 | 39.12,5.84 R11.2 | R10.2 42.04,5.71 41.91,5.84 | 41.91,5.84 39.12,5.84 | 41.91,5.84 42.04,5.97 42.04,6.1 | 42.04,6.1 R9.2 | C9.1 42.29,5.84 42.04,6.1 | v34.97,5.04 v34.97,3.78 | v34.97,5.04 34.92,5 v34.92,2.7
  Bottom 0.813: U$1.2 27.05,3.51 27.86,2.7 v34.92,2.7 34.92,3.78 | v34.97,3.78 v34.97,5.04
VREF
  Top 0.254: IC4.11 44.7,21.97 45.59,21.08 45.59,20.57 51.69,14.48 51.69,13.6 C8.1 51.67,11.67 IC5.2

### Text on the board
Top: TOP
Bottom: BOT
tDocu: Sensor PCB v1 / J.Repcik 7/2019 | MG-812 / TGS4161 | TGS2611 / TGS2612 / TGS2620 | TGS5042 | 1 | 4 | 2 | 3 | U$1 con. / BOTTOM / assembly